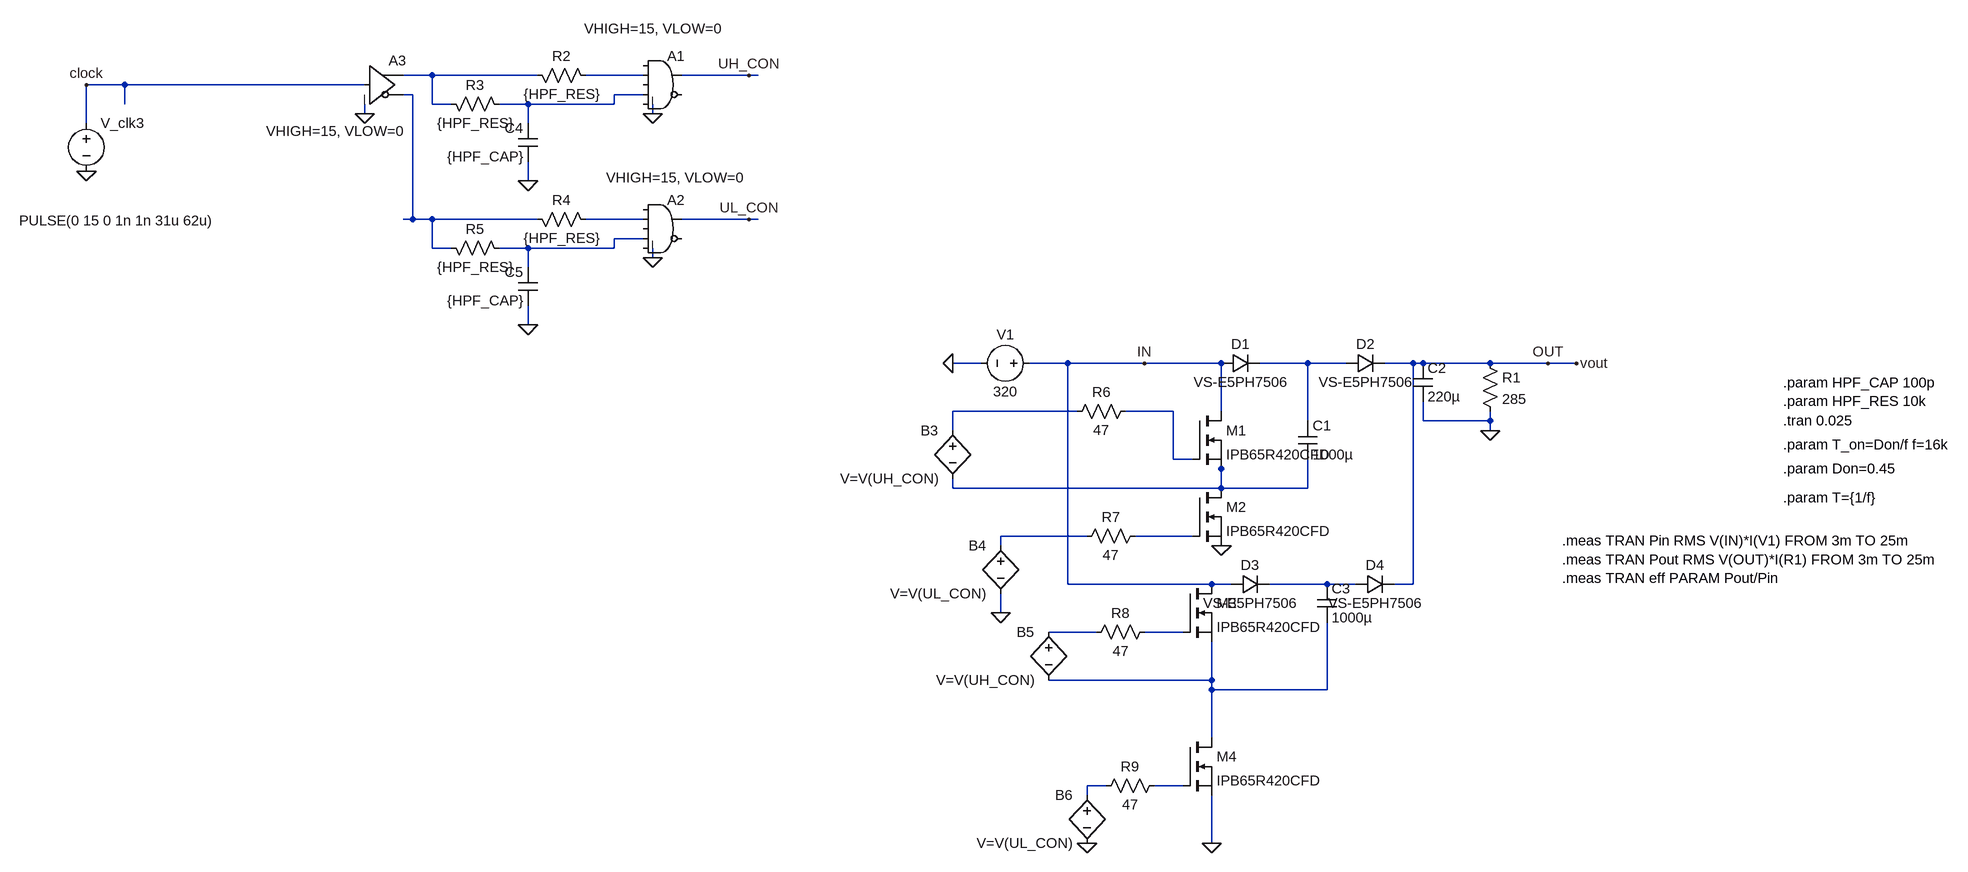
[diagram p0: schematic draft_interleaved_26032028.asc]
draft_interleaved_26032028.asc, the LTspice schematic file:
Version 4
SHEET 1 1456 1024
WIRE -1376 -464 -1424 -464
WIRE -1200 -464 -1376 -464
WIRE -1024 -464 -1120 -464
WIRE -848 -464 -960 -464
WIRE -832 -464 -848 -464
WIRE -1888 -448 -1952 -448
WIRE -1488 -448 -1888 -448
WIRE -1408 -432 -1424 -432
WIRE -1024 -432 -1072 -432
WIRE -1888 -416 -1888 -448
WIRE -1376 -416 -1376 -464
WIRE -1344 -416 -1376 -416
WIRE -1216 -416 -1264 -416
WIRE -1072 -416 -1072 -432
WIRE -1072 -416 -1216 -416
WIRE -1488 -400 -1488 -416
WIRE -1008 -400 -1008 -416
WIRE -1952 -384 -1952 -448
WIRE -1216 -384 -1216 -416
WIRE -1216 -288 -1216 -320
WIRE -1408 -224 -1408 -432
WIRE -1408 -224 -1424 -224
WIRE -1376 -224 -1408 -224
WIRE -1200 -224 -1376 -224
WIRE -1024 -224 -1120 -224
WIRE -848 -224 -960 -224
WIRE -832 -224 -848 -224
WIRE -1024 -192 -1072 -192
WIRE -1376 -176 -1376 -224
WIRE -1344 -176 -1376 -176
WIRE -1216 -176 -1264 -176
WIRE -1072 -176 -1072 -192
WIRE -1072 -176 -1216 -176
WIRE -1008 -160 -1008 -176
WIRE -1216 -144 -1216 -176
WIRE -1216 -48 -1216 -80
WIRE -192 16 -240 16
WIRE -48 16 -112 16
WIRE 80 16 -48 16
WIRE 208 16 80 16
WIRE 352 16 272 16
WIRE 416 16 352 16
WIRE 528 16 480 16
WIRE 544 16 528 16
WIRE 656 16 544 16
WIRE 752 16 656 16
WIRE 800 16 752 16
WIRE -32 96 -240 96
WIRE 128 96 48 96
WIRE 208 96 208 16
WIRE 352 112 352 16
WIRE 544 112 544 80
WIRE 656 112 656 96
WIRE 656 112 544 112
WIRE -240 128 -240 96
WIRE 656 128 656 112
WIRE 128 176 128 96
WIRE 160 176 128 176
WIRE 208 192 208 160
WIRE -240 224 -240 208
WIRE 208 224 208 192
WIRE 208 224 -240 224
WIRE 352 224 352 176
WIRE 352 224 208 224
WIRE -16 304 -160 304
WIRE 160 304 64 304
WIRE -160 320 -160 304
WIRE -48 384 -48 16
WIRE 192 384 -48 384
WIRE 224 384 192 384
WIRE 384 384 288 384
WIRE 432 384 384 384
WIRE 528 384 528 16
WIRE 528 384 496 384
WIRE -160 432 -160 400
WIRE 0 464 -80 464
WIRE 144 464 80 464
WIRE 192 544 192 480
WIRE 192 544 -80 544
WIRE 192 560 192 544
WIRE 384 560 384 448
WIRE 384 560 192 560
WIRE 192 640 192 560
WIRE 16 720 -16 720
WIRE 144 720 96 720
WIRE -16 736 -16 720
WIRE 192 816 192 736
FLAG -240 16 0
FLAG 208 320 0
FLAG 800 16 vout
FLAG 656 128 0
FLAG 192 816 0
FLAG 80 16 IN
FLAG 752 16 OUT
FLAG -1952 -448 clock
FLAG -1952 -304 0
FLAG -848 -464 UH_CON
FLAG -848 -224 UL_CON
FLAG -1216 -288 0
FLAG -1216 -48 0
FLAG -1008 -400 0
FLAG -1008 -160 0
FLAG -1488 -400 0
FLAG -160 432 0
FLAG -16 816 0
SYMBOL voltage -96 16 R90
WINDOW 3 32 56 VTop 2
WINDOW 0 -32 56 VBottom 2
SYMATTR Value 320
SYMATTR InstName V1
SYMBOL diode 208 32 R270
WINDOW 0 32 32 VTop 2
WINDOW 3 0 32 VBottom 2
SYMATTR InstName D1
SYMATTR Value VS-E5PH7506
SYMBOL diode 416 32 R270
WINDOW 0 32 32 VTop 2
WINDOW 3 0 32 VBottom 2
SYMATTR InstName D2
SYMATTR Value VS-E5PH7506
SYMBOL diode 224 400 R270
WINDOW 0 32 32 VTop 2
WINDOW 3 0 32 VBottom 2
SYMATTR InstName D3
SYMATTR Value VS-E5PH7506
SYMBOL diode 432 400 R270
WINDOW 0 32 32 VTop 2
WINDOW 3 0 32 VBottom 2
SYMATTR InstName D4
SYMATTR Value VS-E5PH7506
SYMBOL cap 336 112 R0
SYMATTR InstName C1
SYMATTR Value 1000µ
SYMBOL cap 528 16 R0
SYMATTR InstName C2
SYMATTR Value 220µ
SYMBOL res 640 0 R0
SYMATTR InstName R1
SYMATTR Value 285
SYMBOL cap 368 384 R0
SYMATTR InstName C3
SYMATTR Value 1000µ
SYMBOL nmos 160 96 R0
SYMATTR InstName M1
SYMATTR Value IPB65R420CFD
SYMBOL nmos 160 224 R0
SYMATTR InstName M2
SYMATTR Value IPB65R420CFD
SYMBOL nmos 144 384 R0
SYMATTR InstName M3
SYMATTR Value IPB65R420CFD
SYMBOL nmos 144 640 R0
SYMATTR InstName M4
SYMATTR Value IPB65R420CFD
SYMBOL voltage -1952 -400 R0
WINDOW 3 -112 178 Left 2
WINDOW 123 0 0 Left 0
WINDOW 39 0 0 Left 0
SYMATTR Value PULSE(0 15 0 1n 1n 31u 62u)
SYMATTR InstName V_clk3
SYMBOL res -1104 -448 M270
WINDOW 0 32 56 VTop 2
WINDOW 3 0 56 VBottom 2
SYMATTR InstName R2
SYMATTR Value {HPF_RES}
SYMBOL Digital\\and -992 -512 R0
WINDOW 3 -130 -30 Left 2
SYMATTR Value VHIGH=15, VLOW=0
SYMATTR InstName A1
SYMBOL Digital\\and -992 -272 R0
WINDOW 3 -94 -21 Left 2
SYMATTR Value VHIGH=15, VLOW=0
SYMATTR InstName A2
SYMBOL Digital\\buf -1488 -512 R0
WINDOW 3 -164 141 Left 2
SYMATTR Value VHIGH=15, VLOW=0
SYMATTR InstName A3
SYMBOL res -1248 -400 M270
WINDOW 0 32 56 VTop 2
WINDOW 3 0 56 VBottom 2
SYMATTR InstName R3
SYMATTR Value {HPF_RES}
SYMBOL res -1104 -208 M270
WINDOW 0 32 56 VTop 2
WINDOW 3 0 56 VBottom 2
SYMATTR InstName R4
SYMATTR Value {HPF_RES}
SYMBOL res -1248 -160 M270
WINDOW 0 32 56 VTop 2
WINDOW 3 0 56 VBottom 2
SYMATTR InstName R5
SYMATTR Value {HPF_RES}
SYMBOL cap -1200 -384 M0
SYMATTR InstName C4
SYMATTR Value {HPF_CAP}
SYMBOL cap -1200 -144 M0
SYMATTR InstName C5
SYMATTR Value {HPF_CAP}
SYMBOL bv -240 112 M0
SYMATTR InstName B3
SYMATTR Value V=V(UH_CON)
SYMBOL bv -160 304 M0
SYMATTR InstName B4
SYMATTR Value V=V(UL_CON)
SYMBOL bv -80 448 M0
SYMATTR InstName B5
SYMATTR Value V=V(UH_CON)
SYMBOL bv -16 720 M0
SYMATTR InstName B6
SYMATTR Value V=V(UL_CON)
SYMBOL res 64 80 R90
WINDOW 0 0 56 VBottom 2
WINDOW 3 32 56 VTop 2
SYMATTR InstName R6
SYMATTR Value 47
SYMBOL res 80 288 R90
WINDOW 0 0 56 VBottom 2
WINDOW 3 32 56 VTop 2
SYMATTR InstName R7
SYMATTR Value 47
SYMBOL res 96 448 R90
WINDOW 0 0 56 VBottom 2
WINDOW 3 32 56 VTop 2
SYMATTR InstName R8
SYMATTR Value 47
SYMBOL res 112 704 R90
WINDOW 0 0 56 VBottom 2
WINDOW 3 32 56 VTop 2
SYMATTR InstName R9
SYMATTR Value 47
TEXT 1144 192 Left 2 !.param Don=0.45
TEXT 1144 240 Left 2 !.param T={1/f}
TEXT 1144 152 Left 2 !.param T_on=Don/f f=16k
TEXT 776 312 Left 2 !.meas TRAN Pin RMS V(IN)*I(V1) FROM 3m TO 25m\n.meas TRAN Pout RMS V(OUT)*I(R1) FROM 3m TO 25m\n.meas TRAN eff PARAM Pout/Pin
TEXT 1144 112 Left 2 !.tran 0.025
TEXT 1144 48 Left 2 !.param HPF_CAP 100p\n.param HPF_RES 10k

The netlist it stands for:
* draft_interleaved_26032028.asc
V1 IN 0 320
D1 IN N007 VS-E5PH7506
D2 N007 OUT VS-E5PH7506
D3 IN N013 VS-E5PH7506
D4 N013 OUT VS-E5PH7506
C1 N007 N010 1000µ
C2 OUT 0 220µ
R1 OUT 0 285
C3 N013 N016 1000µ
M1 IN N009 N010 N010 IPB65R420CFD
M2 N010 N012 0 0 IPB65R420CFD
M3 IN N015 N016 N016 IPB65R420CFD
M4 N016 N018 0 0 IPB65R420CFD
V_clk3 clock 0 PULSE(0 15 0 1n 1n 31u 62u)
R2 N002 N001 {HPF_RES}
A1 0 N002 0 N004 0 0 UH_CON 0 AND VHIGH=15, VLOW=0
A2 0 N005 0 N006 0 0 UL_CON 0 AND VHIGH=15, VLOW=0
A3 clock 0 0 0 0 N003 N001 0 BUF VHIGH=15, VLOW=0
R3 N004 N001 {HPF_RES}
R4 N005 N003 {HPF_RES}
R5 N006 N003 {HPF_RES}
C4 N004 0 {HPF_CAP}
C5 N006 0 {HPF_CAP}
B3 N008 N010 V=V(UH_CON)
B4 N011 0 V=V(UL_CON)
B5 N014 N016 V=V(UH_CON)
B6 N017 0 V=V(UL_CON)
R6 N009 N008 47
R7 N012 N011 47
R8 N015 N014 47
R9 N018 N017 47
.model D D
.lib standard.dio
.model NMOS NMOS
.model PMOS PMOS
.lib standard.mos
.param Don=0.45
.param T={1/f}
.param T_on=Don/f f=16k
.meas TRAN Pin RMS V(IN)*I(V1) FROM 3m TO 25m
.meas TRAN Pout RMS V(OUT)*I(R1) FROM 3m TO 25m
.meas TRAN eff PARAM Pout/Pin
.tran 0.025
.param HPF_CAP 100p
.param HPF_RES 10k
.backanno
.end